# Altium schematic sheet optic_fiber_tx.SchDoc
size A4; SheetNumber: 1; SheetTotal: 1
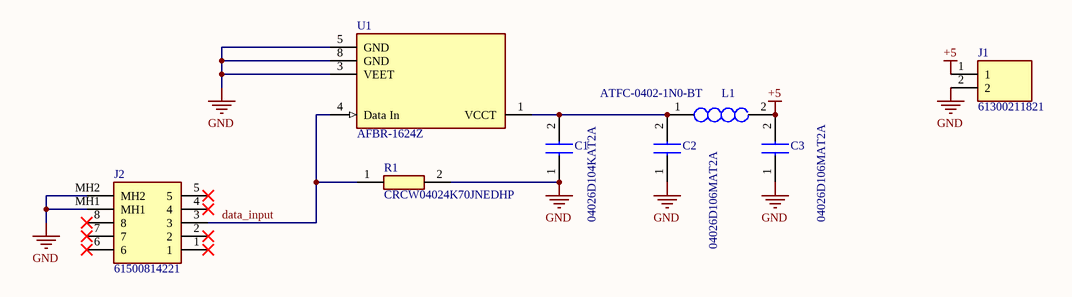
[diagram p0: optic_fiber_tx.SchDoc]

## Parts
C1  04026D104KAT2A  [CAPC1005X56N]
C2  04026D106MAT2A  [CAPC1005X56N]
C3  04026D106MAT2A  [CAPC1005X56N]
J1  61300211821  [61300211821]
J2  61500814221  [61500814221]
L1  ATFC-0402-1N0-BT  [INDC1005X37N]
R1  CRCW04024K70JNEDHP  [RESC1005X40N]
U1  AFBR-1624Z  [FP-AFBR-1624Z-MFG]

## Nets
+5: C3.2 J1.1 L1.2
GND: C1.1 C2.1 C3.1 J1.2 J2.MH1 J2.MH2 R1.2 U1.3(VEET) U1.5(GND) U1.8(GND)
data_input: J2.3 R1.1 U1.4(Data_In)
NetC1_2: C1.2 C2.2 L1.1 U1.1(VCCT)

Not connected (* = marked no-connect by the designer): J2 1* 2* 4* 5* 6* 7* 8*

## Library data of the parts
C1 = 04026D104KAT2A: Capacitor; Manufacturer_Name: Kyocera AVX; Datasheet Link: http://www.mouser.com/catalog/supplier/library/pdf/AVXSurfaceMountCeramic.pdf; Height: 0.56mm; Manufacturer_Part_Number: 04026D104KAT2A; Mouser Part Number: 581-04026D104KAT2A; Mouser Price/Stock: https://www.mouser.co.uk/ProductDetail/AVX/04026D104KAT2A?qs=LLG2yGGJ5NhILwMziGI8Xg%3D%3D; Arrow Part Number: 04026D104KAT2A; Arrow Price/Stock: https://www.arrow.com/en/products/04026d104kat2a/avx?region=nac
C2 C3 = 04026D106MAT2A: Capacitor; Manufacturer_Name: Kyocera AVX; Datasheet Link: http://www.mouser.com/catalog/supplier/library/pdf/AVXSurfaceMountCeramic.pdf; Height: 0.56mm; Manufacturer_Part_Number: 04026D106MAT2A; Mouser Part Number: 581-04026D106MAT2A; Mouser Price/Stock: https://www.mouser.co.uk/ProductDetail/AVX/04026D106MAT2A?qs=XLNwXgtzMM9wXpSOj34Byg%3D%3D; Arrow Part Number: 04026D106MAT2A; Arrow Price/Stock: https://www.arrow.com/en/products/04026d106mat2a/avx
J1 = 61300211821: Connector; Manufacturer_Name: Wurth Elektronik; Datasheet Link: https://www.we-online.com/catalog/datasheet/61300211821.pdf; Height: 8.65mm; Manufacturer_Part_Number: 61300211821
J2 = 61500814221: Connector; Manufacturer_Name: Wurth Elektronik; Datasheet Link: http://katalog.we-online.de/em/datasheet/61500814221.pdf; Height: 16.53mm; Manufacturer_Part_Number: 61500814221; Mouser Part Number: 710-61500814221; Mouser Price/Stock: https://www.mouser.co.uk/ProductDetail/Wurth-Elektronik/61500814221?qs=rS3zZhy2AQOW6FITBQg0lg%3D%3D
L1 = ATFC-0402-1N0-BT: Inductor; Manufacturer_Name: ABRACON; Datasheet Link: http://www.mouser.com/ds/2/3/ATFC-0402-6001.pdf; Height: 0.37mm; Manufacturer_Part_Number: ATFC-0402-1N0-BT; Mouser Part Number: 815-ATFC-0402-1N0-BT
R1 = CRCW04024K70JNEDHP: Resistor; Manufacturer_Name: Vishay; Datasheet Link: http://www.vishay.com/docs/20035/dcrcwe3.pdf; Height: 0.4mm; Manufacturer_Part_Number: CRCW04024K70JNEDHP; Mouser Part Number: 71-CRCW04024K70JNEDH; Mouser Price/Stock: https://www.mouser.co.uk/ProductDetail/Vishay-Dale/CRCW04024K70JNEDHP?qs=k2%2FDWSARqgGhgirK%2FulFyA%3D%3D; Arrow Part Number: CRCW04024K70JNEDHP; Arrow Price/Stock: https://www.arrow.com/en/products/crcw04024k70jnedhp/vishay?region=nac
U1 = CMP-18396-000003-1: TXRX OPT 650NM 1MM POF; Operating Supply Voltage: 3.3V; Operating Supply Current: 21mA; Rise Time: 5ns; Number of Pins: 6; Series: Versatile Link; Max Operating Temperature: 85°C; Mount: Through Hole; Min Operating Temperature: -40°C; REACH SVHC: No SVHC; Length: 18.8mm; Height: 7.62mm; Width: 12.19mm; Wavelength: 650nm; Forward Current: 21mA; Fall Time: 5ns; Package Quantity: 200; Forward Voltage: 3.3V